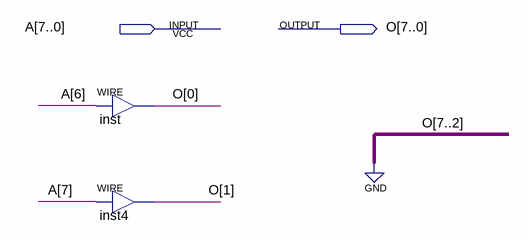
[diagram p0: schematic sheet]
// Quartus schematic g27_8bit_shift_6right.bdf as structural Verilog: 2 symbols, 2 pins
module g27_8bit_shift_6right (
  input  [7:0] A,
  output [7:0] O
);

  assign O[0] = A[6];  // WIRE inst
  assign O[1] = A[7];  // WIRE inst4

  assign O[7:2] = {6{1'b0}};
endmodule
